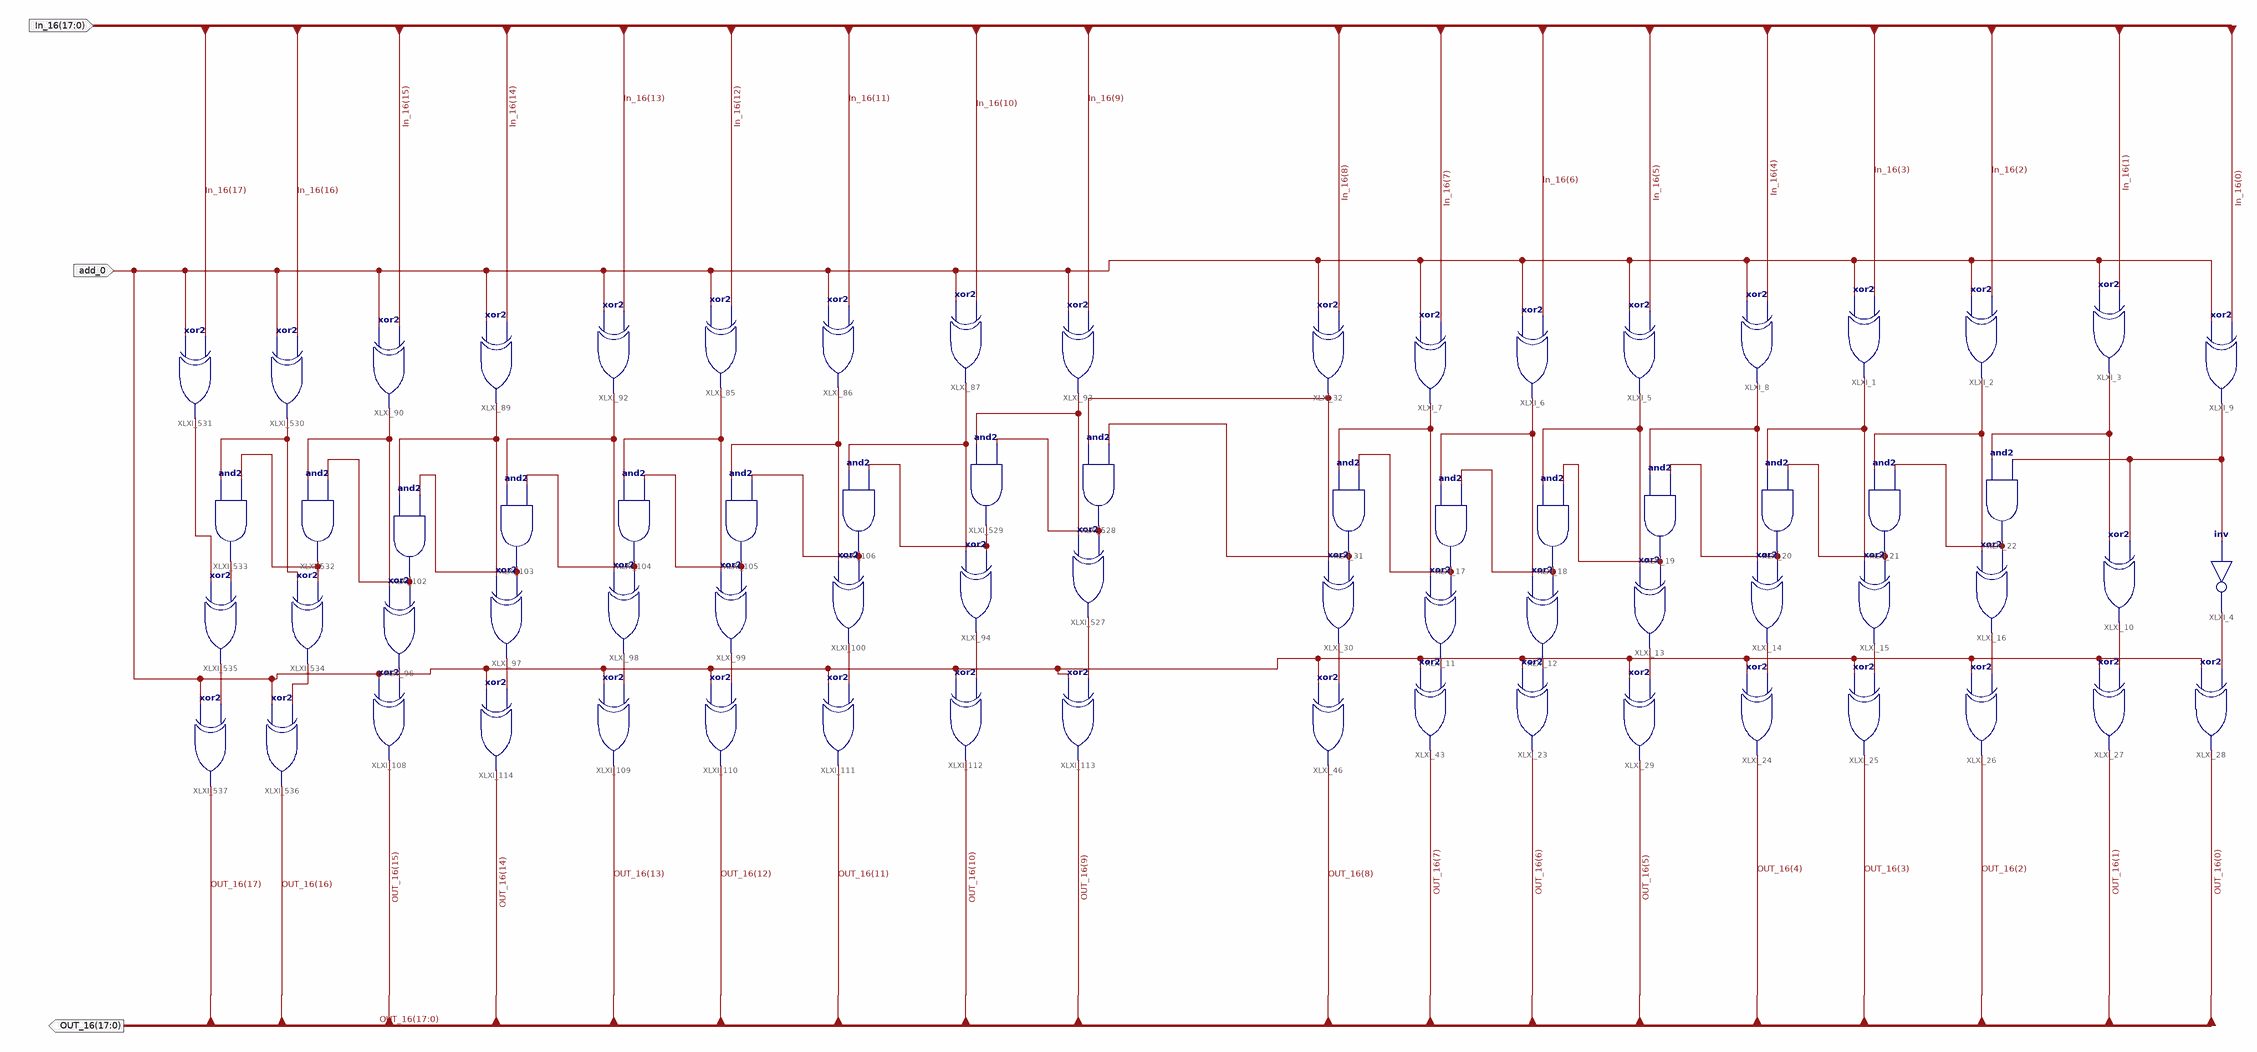
[diagram p0: schematic sheet 1]
// Xilinx ISE schematic Incre_dcre_18.sch (spartan3e) as structural Verilog: 70 symbols, 3 ports
module Incre_dcre_18 (
  input  [17:0] In_16,
  input  add_0,
  output [17:0] OUT_16
);

  wire XLXN_1, XLXN_2, XLXN_3, XLXN_4, XLXN_5, XLXN_6, XLXN_7, XLXN_8, XLXN_10, XLXN_11, XLXN_12, XLXN_13,
       XLXN_14, XLXN_15, XLXN_16, XLXN_17, XLXN_18, XLXN_19, XLXN_20, XLXN_21, XLXN_22, XLXN_23, XLXN_24,
       XLXN_50, XLXN_52, XLXN_120, XLXN_121, XLXN_122, XLXN_123, XLXN_126, XLXN_127, XLXN_129, XLXN_130,
       XLXN_131, XLXN_133, XLXN_134, XLXN_135, XLXN_136, XLXN_137, XLXN_140, XLXN_971, XLXN_976, XLXN_982,
       XLXN_989, XLXN_1009, XLXN_1013, XLXN_1015, XLXN_1016, XLXN_1018, XLXN_1019, XLXN_1025, XLXN_1026;

  xor XLXI_1 (XLXN_2, add_0, In_16[3]);
  xor XLXI_2 (XLXN_3, add_0, In_16[2]);
  xor XLXI_3 (XLXN_4, add_0, In_16[1]);
  not XLXI_4 (XLXN_14, XLXN_52);
  xor XLXI_5 (XLXN_1, add_0, In_16[5]);
  xor XLXI_6 (XLXN_13, add_0, In_16[6]);
  xor XLXI_7 (XLXN_5, add_0, In_16[7]);
  xor XLXI_8 (XLXN_12, add_0, In_16[4]);
  xor XLXI_9 (XLXN_52, add_0, In_16[0]);
  xor XLXI_10 (XLXN_15, XLXN_4, XLXN_52);
  xor XLXI_11 (XLXN_19, XLXN_5, XLXN_24);
  xor XLXI_12 (XLXN_20, XLXN_13, XLXN_6);
  xor XLXI_13 (XLXN_21, XLXN_1, XLXN_7);
  xor XLXI_14 (XLXN_18, XLXN_12, XLXN_8);
  xor XLXI_15 (XLXN_17, XLXN_2, XLXN_11);
  xor XLXI_16 (XLXN_16, XLXN_3, XLXN_10);
  and XLXI_17 (XLXN_24, XLXN_13, XLXN_6);
  and XLXI_18 (XLXN_6, XLXN_1, XLXN_7);
  and XLXI_19 (XLXN_7, XLXN_12, XLXN_8);
  and XLXI_20 (XLXN_8, XLXN_2, XLXN_11);
  and XLXI_21 (XLXN_11, XLXN_3, XLXN_10);
  and XLXI_22 (XLXN_10, XLXN_4, XLXN_52);
  xor XLXI_23 (OUT_16[6], add_0, XLXN_20);
  xor XLXI_24 (OUT_16[4], add_0, XLXN_18);
  xor XLXI_25 (OUT_16[3], add_0, XLXN_17);
  xor XLXI_26 (OUT_16[2], add_0, XLXN_16);
  xor XLXI_27 (OUT_16[1], add_0, XLXN_15);
  xor XLXI_28 (OUT_16[0], add_0, XLXN_14);
  xor XLXI_29 (OUT_16[5], add_0, XLXN_21);
  xor XLXI_30 (XLXN_22, XLXN_23, XLXN_50);
  and XLXI_31 (XLXN_50, XLXN_5, XLXN_24);
  xor XLXI_32 (XLXN_23, add_0, In_16[8]);
  xor XLXI_114 (OUT_16[14], add_0, XLXN_140);
  xor XLXI_112 (OUT_16[10], add_0, XLXN_134);
  xor XLXI_111 (OUT_16[11], add_0, XLXN_135);
  xor XLXI_110 (OUT_16[12], add_0, XLXN_136);
  xor XLXI_109 (OUT_16[13], add_0, XLXN_137);
  xor XLXI_108 (OUT_16[15], add_0, XLXN_971);
  and XLXI_106 (XLXN_129, XLXN_123, XLXN_982);
  and XLXI_105 (XLXN_130, XLXN_122, XLXN_129);
  and XLXI_104 (XLXN_127, XLXN_121, XLXN_130);
  and XLXI_103 (XLXN_126, XLXN_131, XLXN_127);
  and XLXI_102 (XLXN_1018, XLXN_120, XLXN_126);
  xor XLXI_100 (XLXN_135, XLXN_122, XLXN_129);
  xor XLXI_99 (XLXN_136, XLXN_121, XLXN_130);
  xor XLXI_98 (XLXN_137, XLXN_131, XLXN_127);
  xor XLXI_97 (XLXN_140, XLXN_120, XLXN_126);
  xor XLXI_94 (XLXN_134, XLXN_123, XLXN_982);
  xor XLXI_92 (XLXN_131, add_0, In_16[13]);
  xor XLXI_90 (XLXN_1009, add_0, In_16[15]);
  xor XLXI_89 (XLXN_120, add_0, In_16[14]);
  xor XLXI_87 (XLXN_123, add_0, In_16[10]);
  xor XLXI_86 (XLXN_122, add_0, In_16[11]);
  xor XLXI_85 (XLXN_121, add_0, In_16[12]);
  xor XLXI_96 (XLXN_971, XLXN_1009, XLXN_1018);
  xor XLXI_93 (XLXN_976, add_0, In_16[9]);
  xor XLXI_527 (XLXN_133, XLXN_976, XLXN_989);
  xor XLXI_113 (OUT_16[9], add_0, XLXN_133);
  and XLXI_529 (XLXN_982, XLXN_976, XLXN_989);
  and XLXI_528 (XLXN_989, XLXN_23, XLXN_50);
  xor XLXI_46 (OUT_16[8], add_0, XLXN_22);
  xor XLXI_43 (OUT_16[7], add_0, XLXN_19);
  xor XLXI_530 (XLXN_1015, add_0, In_16[16]);
  xor XLXI_531 (XLXN_1016, add_0, In_16[17]);
  and XLXI_532 (XLXN_1019, XLXN_1009, XLXN_1018);
  and XLXI_533 (XLXN_1013, XLXN_1015, XLXN_1019);
  xor XLXI_534 (XLXN_1026, XLXN_1015, XLXN_1019);
  xor XLXI_535 (XLXN_1025, XLXN_1016, XLXN_1013);
  xor XLXI_536 (OUT_16[16], add_0, XLXN_1026);
  xor XLXI_537 (OUT_16[17], add_0, XLXN_1025);
endmodule
